# Altium schematic sheet embeddedCircuit.SchDoc
size A4
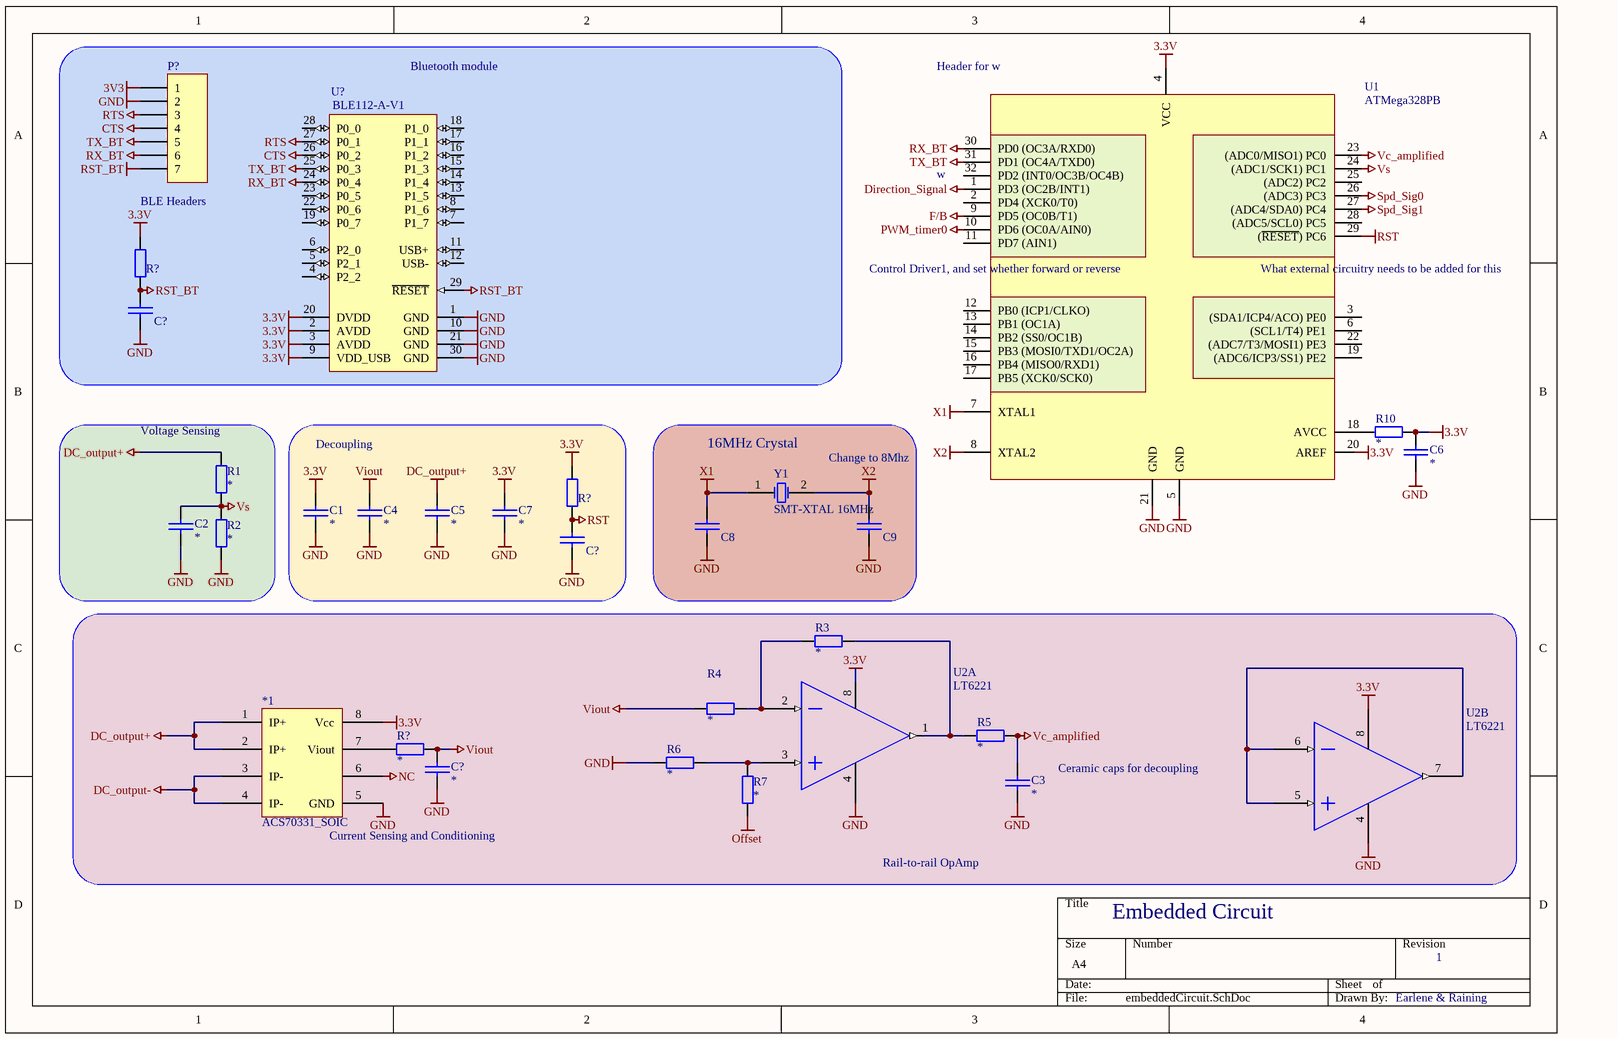
[diagram p0: embeddedCircuit.SchDoc]

## Parts
(Parts that share a designator on the sheet are numbered #1, #2 ... from top to bottom, then left to right.)
*1  ACS70331_SOIC  [ACS70331]
C1  *  [0805 CAP]
C2  *  [0805 CAP]
C3  *  [0805 CAP]
C4  *  [0805 CAP]
C5  *  [0805 CAP]
C6  *  [0805 CAP]
C7  *  [0805 CAP]
C8  Capacitor 0805  [C0805]  (value not drawn)
C9  Capacitor 0805  [C0805]  (value not drawn)
C?#1  Capacitor 0805  [C0805]  (value not drawn)
C?#2  Capacitor 0805  [C0805]  (value not drawn)
C?#3  *  [0805 CAP]
P?  BLE Headers  [HDR1X7]
R1  *  [0805 RES]
R2  *  [0805 RES]
R3  *  [0805 RES]
R4  *  [0805 RES]
R5  *  [0805 RES]
R6  *  [0805 RES]
R7  *  [0805 RES]
R10  *  [0805 RES]
R?#1  Resistor 0805  [R0805]  (value not drawn)
R?#2  Resistor 0805  [R0805]  (value not drawn)
R?#3  *  [0805 RES]
U1  ATMega328PB  [TQFP32]
U2  LT6221  [SOIC8]  (parts A,B of 2)
U?  BLE112-A-V1  [BLUE-BLE112-A-V1_V]
Y1  SMT-XTAL 16MHz  [HC49-US]

## Blocks framed on the sheet
Bluetooth module: C?#1 P? R?#1 U?
Voltage Sensing: C2 R1 R2
Decoupling: C1 C4 C5 C7 C?#2 R?#2
16MHz Crystal: C8 C9 Y1

## Nets
3.3V: *1.8(Vcc) C1.1 C6.1 C7.1 R10.2 R?#1.2 R?#2.2 U1.4(VCC) U2.8(Vs(-)) U?.2(AVDD) U?.3(AVDD) U?.9(VDD_USB) U?.20(DVDD)
3V3: P?.1
CTS: P?.4 U?.26(P0_2)
DC_output+: *1.1(IP+) *1.2(IP+) C5.1 R1.2
DC_output-: *1.3(IP-) *1.4(IP-)
Direction_Signal: U1.1(PD3_(OC2B/INT1))
F/B: U1.9(PD5_(OC0B/T1))
GND: *1.5(GND) C1.2 C2.2 C3.2 C4.2 C5.2 C6.2 C7.2 C8.2 C9.2 C?#1.2 C?#2.2 C?#3.2 P?.2 R2.1 R6.1 U1.5(GND) U1.21(GND) U2.4(Vs(-)) U?.1(GND) U?.10(GND) U?.21(GND) U?.30(GND)
NC: *1.6
Offset: R7.1
PWM_timer0: U1.10(PD6_(OC0A/AIN0))
RST: C?#2.1 R?#2.1 U1.29((~{RESET})_PC6)
RST_BT: C?#1.1 P?.7 R?#1.1 U?.29(~{RESET})
RTS: P?.3 U?.27(P0_1)
RX_BT: P?.6 U1.30(PD0_(OC3A/RXD0)) U?.24(P0_4)
Spd_Sig0: U1.26((ADC3)_PC3)
Spd_Sig1: U1.27((ADC4/SDA0)_PC4)
TX_BT: P?.5 U1.31(PD1_(OC4A/TXD0)) U?.25(P0_3)
Vc_amplified: C3.1 R5.2 U1.23((ADC0/MISO1)_PC0)
Viout: C4.1 C?#3.1 R4.1 R?#3.2
Vs: C2.1 R1.1 R2.2 U1.24((ADC1/SCK1)_PC1)
X1: C8.1 U1.7(XTAL1) Y1.1(OSC1)
X2: C9.1 U1.8(XTAL2) Y1.2(OSC2)
Net*1_7: *1.7(Viout) R?#3.1
NetR3_1: R3.1 R4.2 U2.2(IN1(-))
NetR3_2: R3.2 R5.1 U2.1(OUT1)
NetR6_2: R6.2 R7.2 U2.3(IN1(+))
NetR10_1: R10.1 U1.18(AVCC)
NetU2_5: U2.5(IN2(+)) U2.6(IN2(-)) U2.7(OUT2)

Not connected (* = marked no-connect by the designer): U1 2(PD4_(XCK0/T0)) 3((SDA1/ICP4/ACO)_PE0) 6((SCL1/T4)_PE1) 11(PD7_(AIN1)) 12(PB0_(ICP1/CLKO)) 13(PB1_(OC1A)) 14(PB2_(SS0/OC1B)) 15(PB3_(MOSI0/TXD1/OC2A)) 16(PB4_(MISO0/RXD1)) 17(PB5_(XCK0/SCK0)) 19((ADC6/ICP3/SS1)_PE2) 20(AREF) 22((ADC7/T3/MOSI1)_PE3) 25((ADC2)_PC2) 28((ADC5/SCL0)_PC5) 32(PD2_(INT0/OC3B/OC4B)); U? 4(P2_2) 5(P2_1) 6(P2_0) 7(P1_7) 8(P1_6) 11(USB+) 12(USB-) 13(P1_5) 14(P1_4) 15(P1_3) 16(P1_2) 17(P1_1) 18(P1_0) 19(P0_7) 22(P0_6) 23(P0_5) 28(P0_0)

## Notes on the sheet
- (near U1) Header for w
- (near U1) w
- (near U1) Control Driver1, and set whether forward or reverse
- (near U1) What external circuitry needs to be added for this
- Change to 8Mhz
- Ceramic caps for decoupling
- (near *1) Current Sensing and Conditioning
- Rail-to-rail OpAmp
- Embedded Circuit
- 1
- Earlene & Raining
- Labels drawn without touching a wire or pin: 3.3V

## Library data of the parts
C1-C7 C?#3 = CerCap_SMT_0805: SMT ceramic capacitor 0805 size; Value: *
C8 C9 C?#1 C?#2 = CCAP0805
P? = Header 7: Header, 7-Pin; LatestRevisionDate: 17-Jul-2002; LatestRevisionNote: Re-released for DXP Platform.; Publisher: Altium Limited
R1-R7 R10 R?#3 = Res_SMT_0805: 0805 resistor; Published: 8-Jun-2000; LatestRevisionDate: 17-Jul-2002; LatestRevisionNote: Re-released for DXP Platform.; PackageReference: AXIAL-0.4; Publisher: Altium Limited; Value: *; ComponentLink1Description: https://nz.mouser.com/datasheet/2/315/AOA0000C304-1149620.pdf
R?#1 R?#2 = RES0805
U1 = ATMega328PB: IC MCU 8BIT 32KB FLASH 32TQFP; Supplier 1: Digi-Key; Supplier Part Number 1: ATMEGA328PB-AU-ND; Supplier 2: Digikey; Supplier Part Number 2: ATMEGA328PB-AU-ND
U2 = LT6221: IC OPAMP LT6221 DUAL SM; Manufactuer: Linear Technology; Manufacturer-PN: LT6221CS8#TRPBF; UoA Stock#: OPA000102; Assembly Method: Surface Mount; Item Type: Item; Path: ece/ts/Lists/Stock Inventory; Value: LT6221; Size/Package: S8; Supplier1: Arrow; Supplier1-PN: LT6221CS8#TRPBF; Supplier2: Digikey; Supplier2-PN: LT6221CS8#PBF-ND; Category: OpAmp; Status: Active; Supplier 1: Digikey; Supplier Part Number 1: LT6221CS8#PBF-ND
U? = BLE112-A-V1: Bluetooth(R) Low Energy Single Mode Module / , 2 to 3.6 V, -40 to 85 degC, 30-Pin SMD, RoHS, Tape and Reel; Min Supply Voltage: 2.1 V; Max Supply Voltage: 3.6 V; RoHSCompliant: true; ComponentLink1Description: Manufacturer URL; Min Operating Temperature: -40 degC; ComponentLink2Description: Datasheet; DatasheetVersion: Rev. 1.4, 05/2013; ComponentLink1URL: www.bluegiga.com; Packaging: Cut Tape; Pins: 64; REACH SVHC: No SVHC; Max Operating Temperature: 85 degC; PackageDescription: 30-Pin Surface Mount Device, Body 12.05 x 18.1 mm, Pitch 1.25 mm; ComponentLink2URL: http://www.mouser.com/ds/2/368/Bluegiga_Technologies_BLE112_Datasheet-558666.pdf; PackageReference: BLE112-A-V1; PartNumber: BLE112-A-V1
Y1 = TXC9C-16_XTAL_SMT: 9C-16.000MAAJ-T crystal 16.0000MHZ 18PF SMD; Manufacturer: TXC CORPORATION; Frequency Stability: ±30ppm; Operating Mode: Fundamental; Supplier 1: Digi-Key; Manufacturer Part Number: 9C-16.000MAAJ-T; RoHS: RoHS Compliant; Category: Crystals, Oscillators, Resonators; Stock 1: 11514; Pricing 1: 1=0.75, 10=0.628, 50=0.5656, 100=0.5026, 500=0.47744 (NZD); Packaging: Cut Tape (CT); Part Status: Active; Type: MHz Crystal; Frequency Tolerance: ±30ppm; Load Capacitance: 18pF; Operating Temperature: -20°C ~ 70°C; Ratings: -; Mounting Type: Surface Mount; Package / Case: HC-49/US; Size / Dimension: 0.449" L x 0.189" W (11.40mm x 4.80mm); Height - Seated (Max): 0.161" (4.10mm); ComponentLink1URL: http://www.txccorp.com/download/products/quartz_crystals/2015TXC_9C_32.pdf; ComponentLink1Description: http://www.txccorp.com/download/products/quartz_crystals/2015TXC_9C_32.pdf; Supplier Part Number 1: 887-1059-1-ND